# Altium project keeb1_V2.PrjPcb
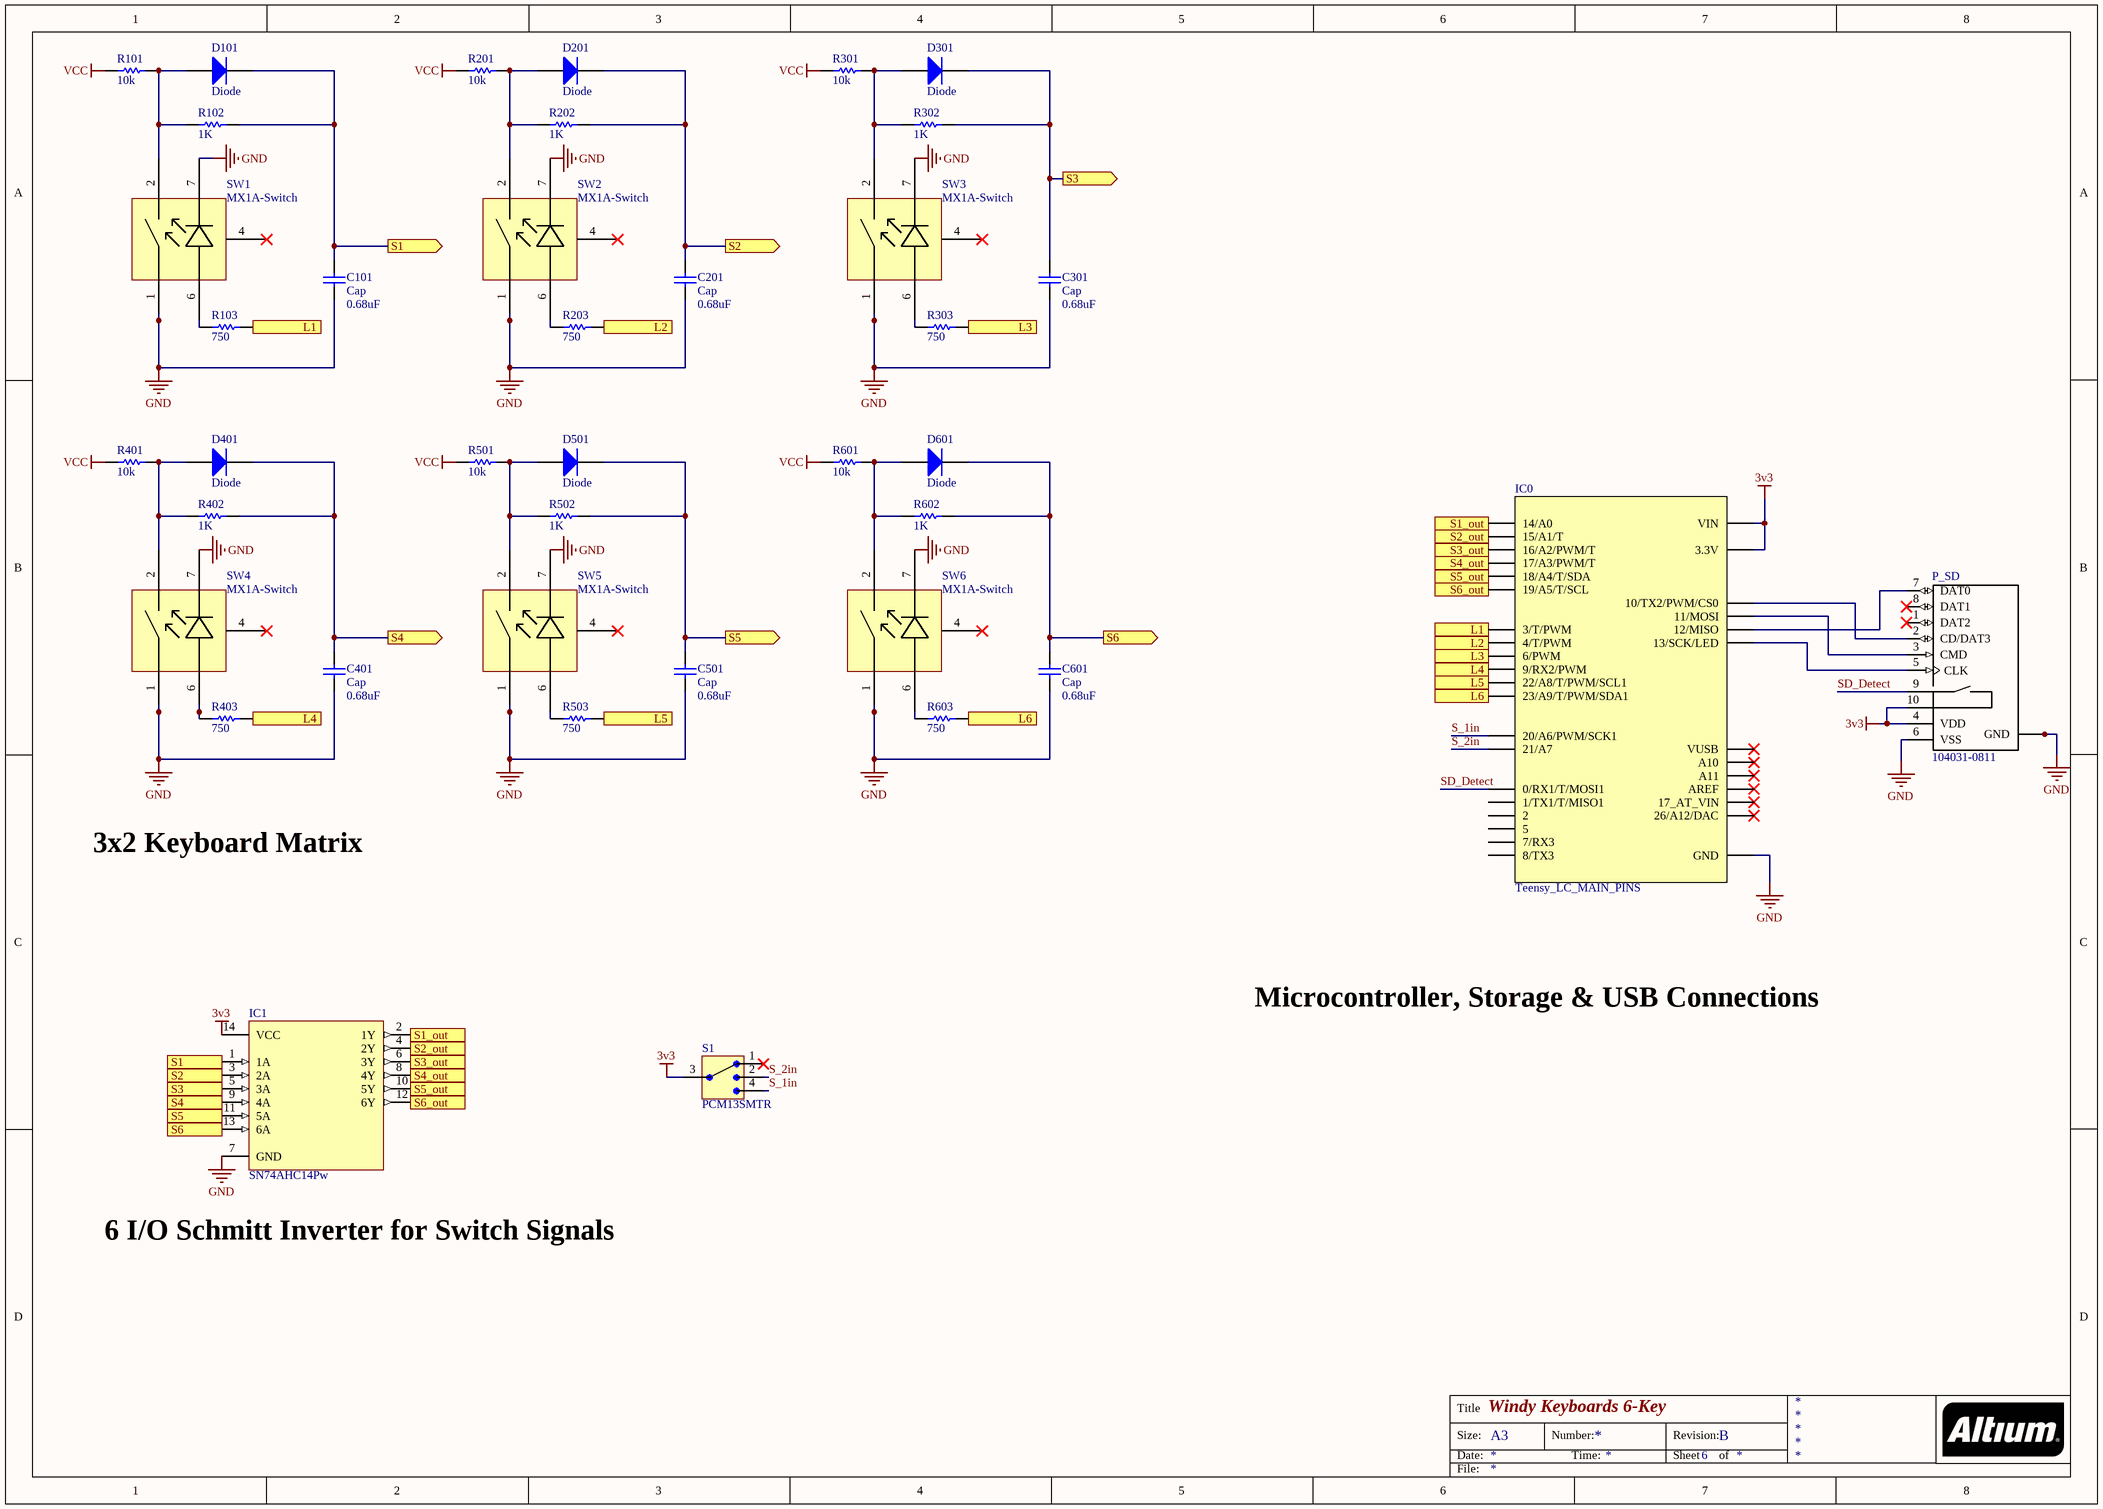
[diagram p0: keeb1_V2.SchDoc]
1 sheet, 40 parts. Net scope: flat (ports and power ports of the same name join across sheets).
Board file: keeb1_V2.PcbDoc

## Sheet keeb1_V2.SchDoc: Windy Keyboards 6-Key
size A3; ApprovedBy: Trent Little; CheckedBy: Trent Little; Author: Trent Little; CompanyName: Windy Keyboards; DrawnBy: Trent Little; Engineer: Trent Little; Revision: B; SheetNumber: 6

### Parts
C101  Cap  value 0.68uF  [C1206]
C201  Cap  value 0.68uF  [C1206]
C301  Cap  value 0.68uF  [C1206]
C401  Cap  value 0.68uF  [C1206]
C501  Cap  value 0.68uF  [C1206]
C601  Cap  value 0.68uF  [C1206]
D101  Diode  [MMDL6050T1G]
D201  Diode  [MMDL6050T1G]
D301  Diode  [MMDL6050T1G]
D401  Diode  [MMDL6050T1G]
D501  Diode  [MMDL6050T1G]
D601  Diode  [MMDL6050T1G]
IC0  Teensy_LC_MAIN_PINS  [Teensy_LC_SMD_MAIN]
IC1  SN74AHC14Pw  [TSSOP-14]
P_SD  104031-0811
R101  value 10k  [C1206]  (hidden comment: Res1)
R102  value 1K  [C1206]  (hidden comment: Res1)
R103  value 750  [C1206]  (hidden comment: Res1)
R201  value 10k  [C1206]  (hidden comment: Res1)
R202  value 1K  [C1206]  (hidden comment: Res1)
R203  value 750  [C1206]  (hidden comment: Res1)
R301  value 10k  [C1206]  (hidden comment: Res1)
R302  value 1K  [C1206]  (hidden comment: Res1)
R303  value 750  [C1206]  (hidden comment: Res1)
R401  value 10k  [C1206]  (hidden comment: Res1)
R402  value 1K  [C1206]  (hidden comment: Res1)
R403  value 750  [C1206]  (hidden comment: Res1)
R501  value 10k  [C1206]  (hidden comment: Res1)
R502  value 1K  [C1206]  (hidden comment: Res1)
R503  value 750  [C1206]  (hidden comment: Res1)
R601  value 10k  [C1206]  (hidden comment: Res1)
R602  value 1K  [C1206]  (hidden comment: Res1)
R603  value 750  [C1206]  (hidden comment: Res1)
S1  PCM13SMTR  [PCM-13SMTR]
SW1  MX1A-Switch  [MX1A-Switch]
SW2  MX1A-Switch  [MX1A-Switch]
SW3  MX1A-Switch  [MX1A-Switch]
SW4  MX1A-Switch  [MX1A-Switch]
SW5  MX1A-Switch  [MX1A-Switch]
SW6  MX1A-Switch  [MX1A-Switch]

### Ports
L1 (in), L2 (in), L3 (in), L4 (in), L5 (in), L6 (in), S1 (in), S1 (out), S1_out (in), S2 (in), S2 (out), S2_out (in), S3 (in), S3 (out), S3_out (in), S4 (in), S4 (out), S4_out (in), S5 (in), S5 (out), S5_out (in), S6 (in), S6 (out), S6_out (in)

### Nets
3v3: IC0.3.3V IC0.VIN IC1.14(VCC) P_SD.4(VDD) P_SD.10(CARD_DET2) S1.3
GND: C101.1 C201.1 C301.1 C401.1 C501.1 C601.1 IC0.GND IC1.7(GND) P_SD.6(VSS) P_SD.G1(GND) P_SD.G2(GND) P_SD.G3(GND) P_SD.G4(GND) SW1.1 SW1.7 SW2.1 SW2.7 SW3.1 SW3.7 SW4.1 SW4.7 SW5.1 SW5.7 SW6.1 SW6.7
VCC: R101.2 R201.2 R301.2 R401.2 R501.2 R601.2
S_1in: IC0.20/A6(20/A6/PWM/SCK1) S1.4
S_2in: IC0.21/A7 S1.2
SD_Detect: IC0.0(0/RX1/T/MOSI1) P_SD.9(CARD_DET1)
NetC101_2: C101.2 D101.2(K) IC1.1(1A) R102.1 ; port S1
NetC201_2: C201.2 D201.2(K) IC1.3(2A) R202.1 ; port S2
NetC301_2: C301.2 D301.2(K) IC1.5(3A) R302.1 ; port S3
NetC401_2: C401.2 D401.2(K) IC1.9(4A) R402.1 ; port S4
NetC501_2: C501.2 D501.2(K) IC1.11(5A) R502.1 ; port S5
NetC601_2: C601.2 D601.2(K) IC1.13(6A) R602.1 ; port S6
NetD101_1: D101.1(A) R101.1 R102.2 SW1.2
NetD201_1: D201.1(A) R201.1 R202.2 SW2.2
NetD301_1: D301.1(A) R301.1 R302.2 SW3.2
NetD401_1: D401.1(A) R401.1 R402.2 SW4.2
NetD501_1: D501.1(A) R501.1 R502.2 SW5.2
NetD601_1: D601.1(A) R601.1 R602.2 SW6.2
NetIC0_3: IC0.3(3/T/PWM) R103.1 ; port L1
NetIC0_4: IC0.4(4/T/PWM) R203.1 ; port L2
NetIC0_6: IC0.6(6/PWM) R303.1 ; port L3
NetIC0_9: IC0.9(9/RX2/PWM) R403.1 ; port L4
NetIC0_10: IC0.10(10/TX2/PWM/CS0) P_SD.2(CD/DAT3)
NetIC0_11: IC0.11(11/MOSI) P_SD.3(CMD)
NetIC0_12: IC0.12(12/MISO) P_SD.7(DAT0)
NetIC0_13: IC0.13(13/SCK/LED) P_SD.5(CLK)
NetIC0_14/A0: IC0.14/A0 IC1.2(1Y) ; port S1_out
NetIC0_15/A1: IC0.15/A1(15/A1/T) IC1.4(2Y) ; port S2_out
NetIC0_16/A2: IC0.16/A2(16/A2/PWM/T) IC1.6(3Y) ; port S3_out
NetIC0_17/A3: IC0.17/A3(17/A3/PWM/T) IC1.8(4Y) ; port S4_out
NetIC0_18/A4: IC0.18/A4(18/A4/T/SDA) IC1.10(5Y) ; port S5_out
NetIC0_19/A5: IC0.19/A5(19/A5/T/SCL) IC1.12(6Y) ; port S6_out
NetIC0_22/A8: IC0.22/A8(22/A8/T/PWM/SCL1) R503.1 ; port L5
NetIC0_23/A9: IC0.23/A9(23/A9/T/PWM/SDA1) R603.1 ; port L6
NetR103_2: R103.2 SW1.6
NetR203_2: R203.2 SW2.6
NetR303_2: R303.2 SW3.6
NetR403_2: R403.2 SW4.6
NetR503_2: R503.2 SW5.6
NetR603_2: R603.2 SW6.6

Not connected (* = marked no-connect by the designer): IC0 1(1/TX1/T/MISO1) 2 5 7(7/RX3) 8(8/TX3) A10* A11* AREF* RESET/DAC(26/A12/DAC)* VBAT(17_AT_VIN)* VUSB*; P_SD 1(DAT2)* 8(DAT1)*; S1 1*; SW1 4*; SW2 4*; SW3 4*; SW4 4*; SW5 4*; SW6 4*

### Notes on the sheet
- (near P_SD) SD, uSD, Description
  9, 1, DAT2
  1, 2, DAT3/CD
  2, 3, CMD
  4, 4, Vdd
  5, 5, CLK
  3&6, 6, Vss
  7, 7, DAT0
  8, 8, DAT1
  BR
- 3x2 Keyboard Matrix
- Microcontroller, Storage & USB Connections
- 6 I/O Schmitt Inverter for Switch Signals
- Title
- Size:
- Date:
- A3
- Number:
- Time:
- Revision:
- Sheet
- of
- File:

### Library data of the parts
C101 C201 C301 C401 C501 C601 = Cap: Capacitor; Published: 8-Jun-2000; LatestRevisionDate: 17-Jul-2002; LatestRevisionNote: Re-released for DXP Platform.; PackageReference: RAD-0.3; Publisher: Altium Limited; PackageDescription: Radial Cap, Thru-Hole; 2 Leads; 0.3 in Pin Spacing
D101 D201 D301 D401 D501 D601 = Diode: Default Diode; Published: 8-Jun-2000; LatestRevisionDate: 17-Jul-2002; LatestRevisionNote: Re-released for DXP Platform.; PackageVersion: Sep-1996; PackageReference: SMC; Publisher: Altium Limited; PackageDescription: DO-214-AB/SMC; 2 C-Bend Leads; Body 7.9 x 5.9 mm, inc. leads (LxW); Code_JEDEC: DO-214-AB
IC1 = SN74AHC14Pw: 6 inverting schmitt trigger
P_SD = SDcard
R101-R103 R201-R203 R301-R303 R401-R403 R501-R503 R601-R603 = Res1: Resistor; Published: 8-Jun-2000; LatestRevisionDate: 17-Jul-2002; LatestRevisionNote: Re-released for DXP Platform.; PackageReference: AXIAL-0.3; Publisher: Altium Limited; PackageDescription: Axial Device, Thru-Hole; 2 Leads; 0.3 in Pin Spacing
S1 = PCM13SMTR: SP3T Ultraminiature surface mount slide switch